# Altium schematic sheet Ref.00_Zynq_Power_Config_1.SchDoc
size A2; SheetNumber: 8; SheetTotal: 11
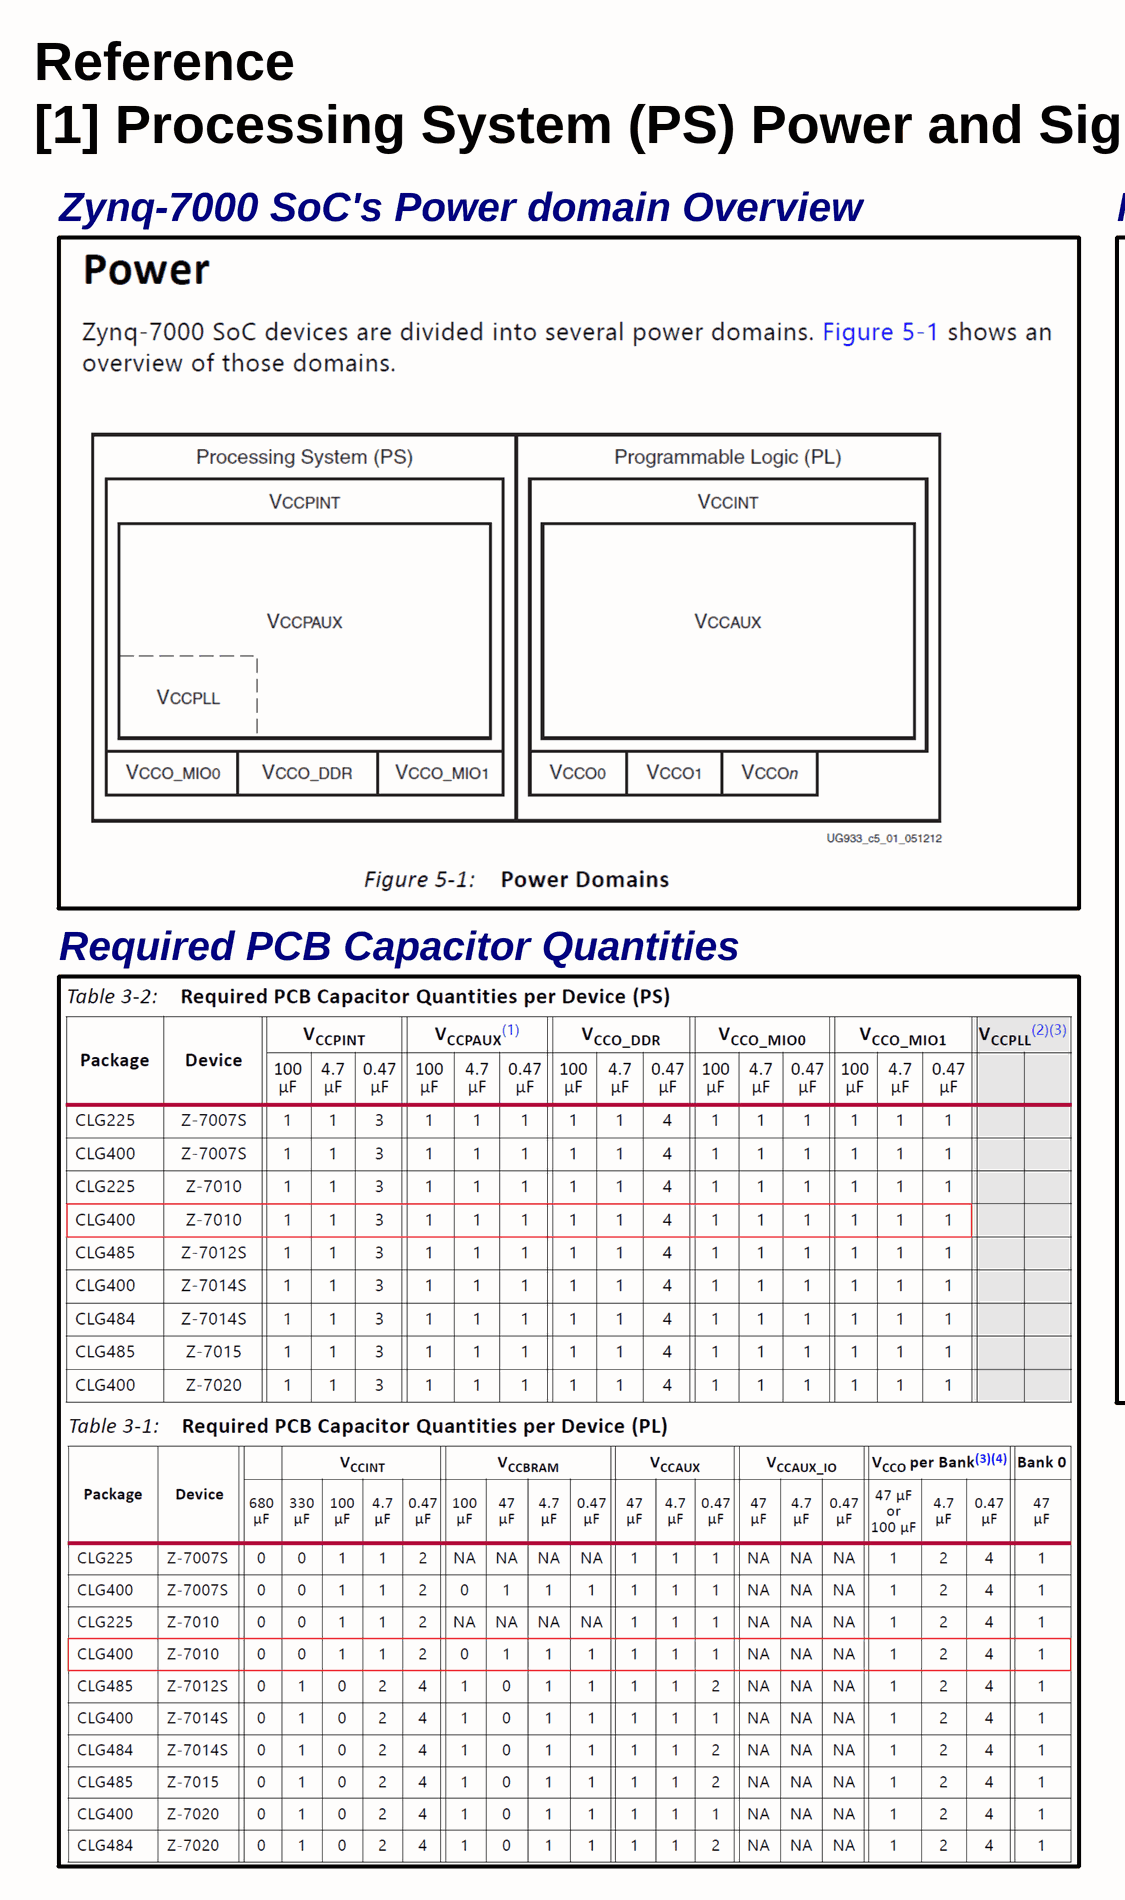
[diagram p0: Ref.00_Zynq_Power_Config_1.SchDoc, left]
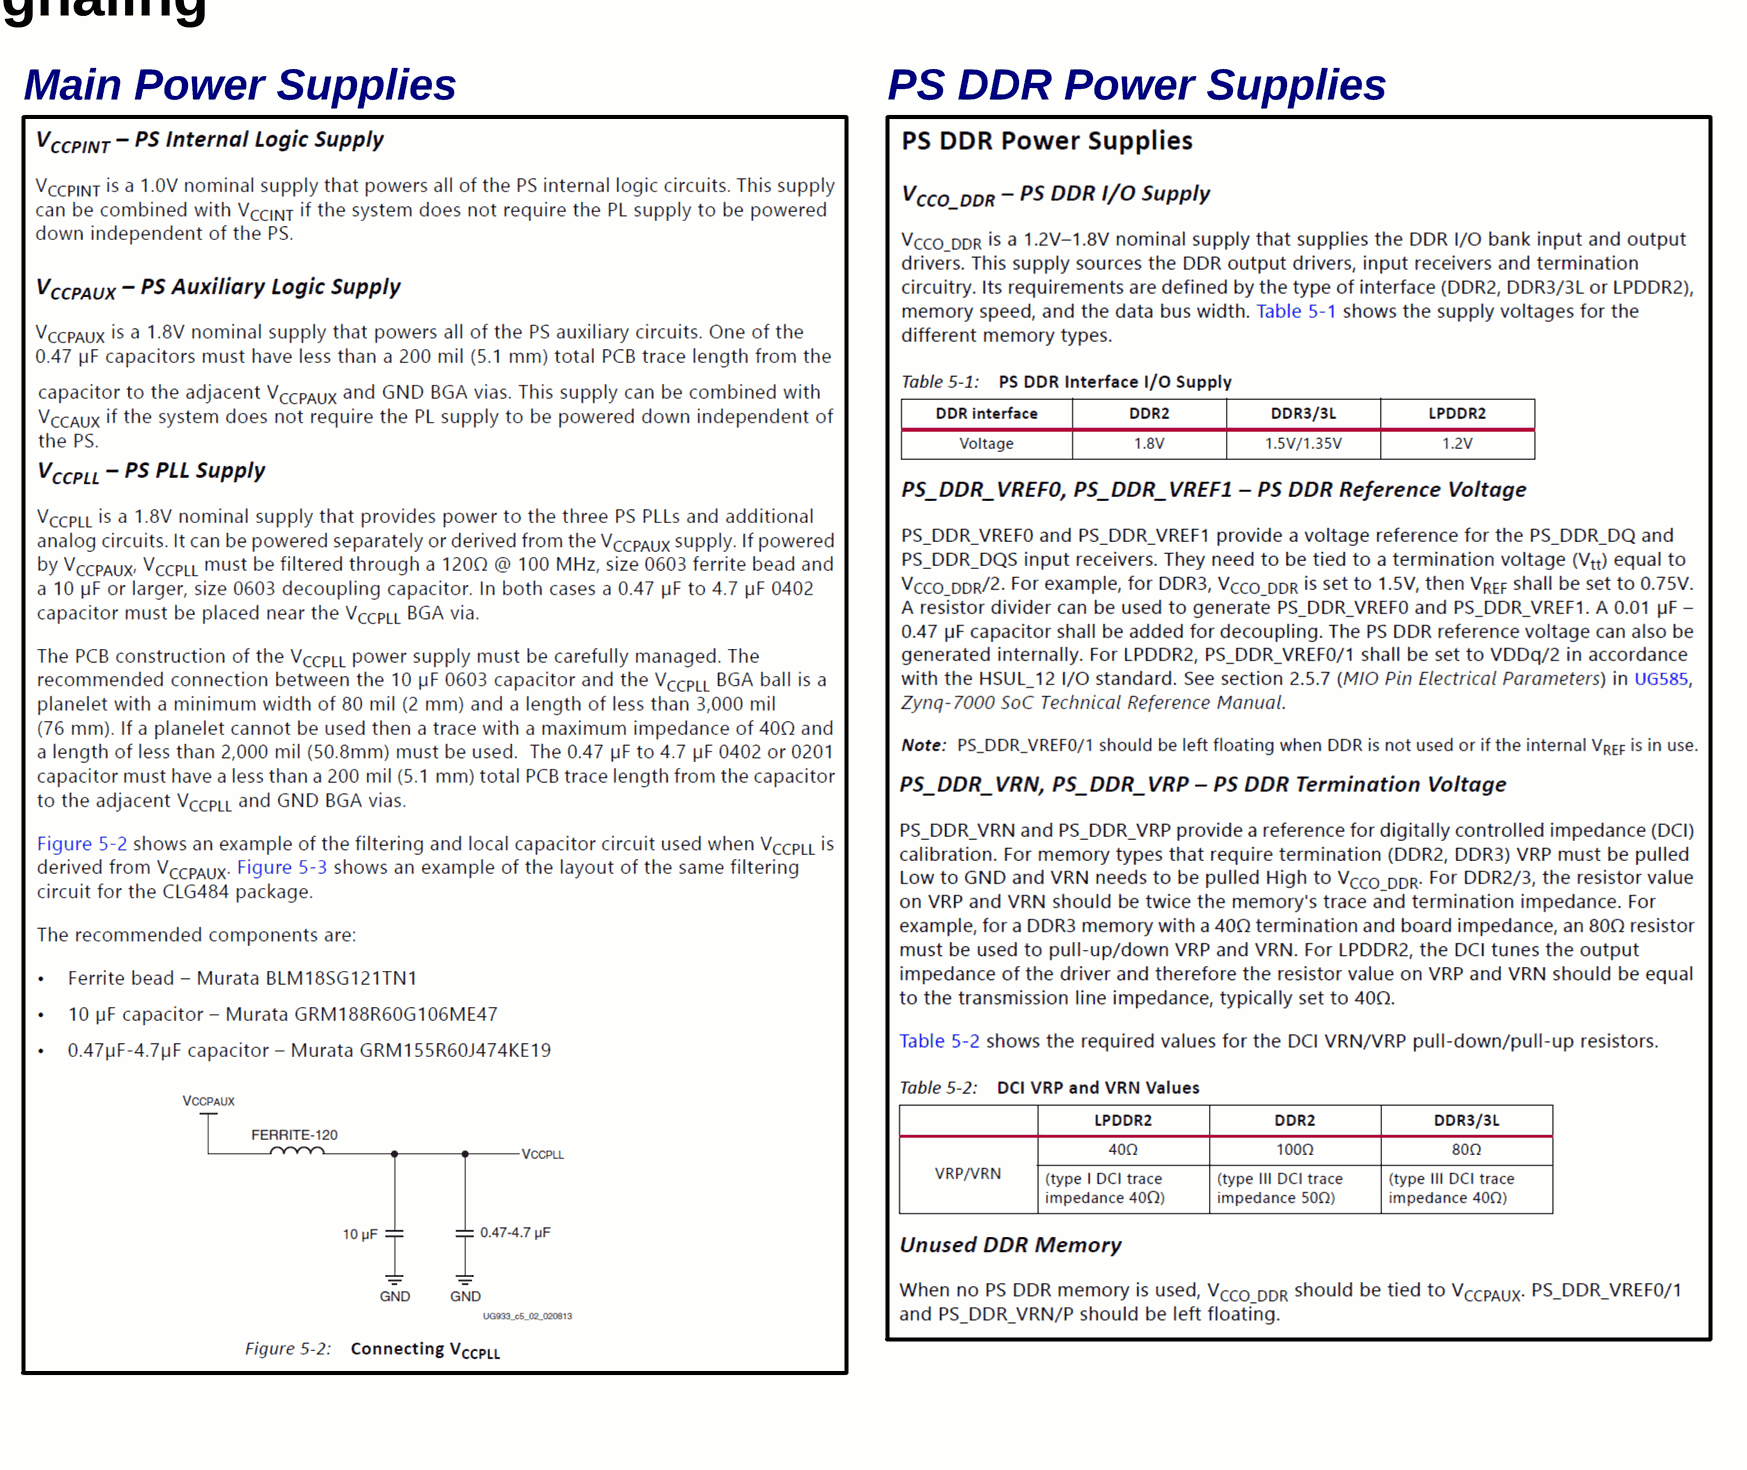
[diagram p1: Ref.00_Zynq_Power_Config_1.SchDoc, right]

## Notes on the sheet
- Reference
- [1] Processing System (PS) Power and Signaling
- Zynq-7000 SoC's Power domain Overview
- Main Power Supplies
- PS DDR Power Supplies
- Required PCB Capacitor Quantities
- Title
- Rev
- Doc
- Sheet #
- of
- Author
- This document is copyright of ArkX and shall not be revealed, produced, copied, in whole or in part,
- Date
- nor used for any purpose other than submitted.